# EasyEDA Pro project ProPrj_NERVA_Charger_2026-04-29.epro

# Schematic Schematic1
Board Name: Board1; Create Date: 2026-04-25; Page Name: P1; Project Name: NERVA_Charger; Schematic Name: Schematic1; Update Date: 2026-04-25; Company: EasyEDA.com; Page Size: A4; Version: V1.0
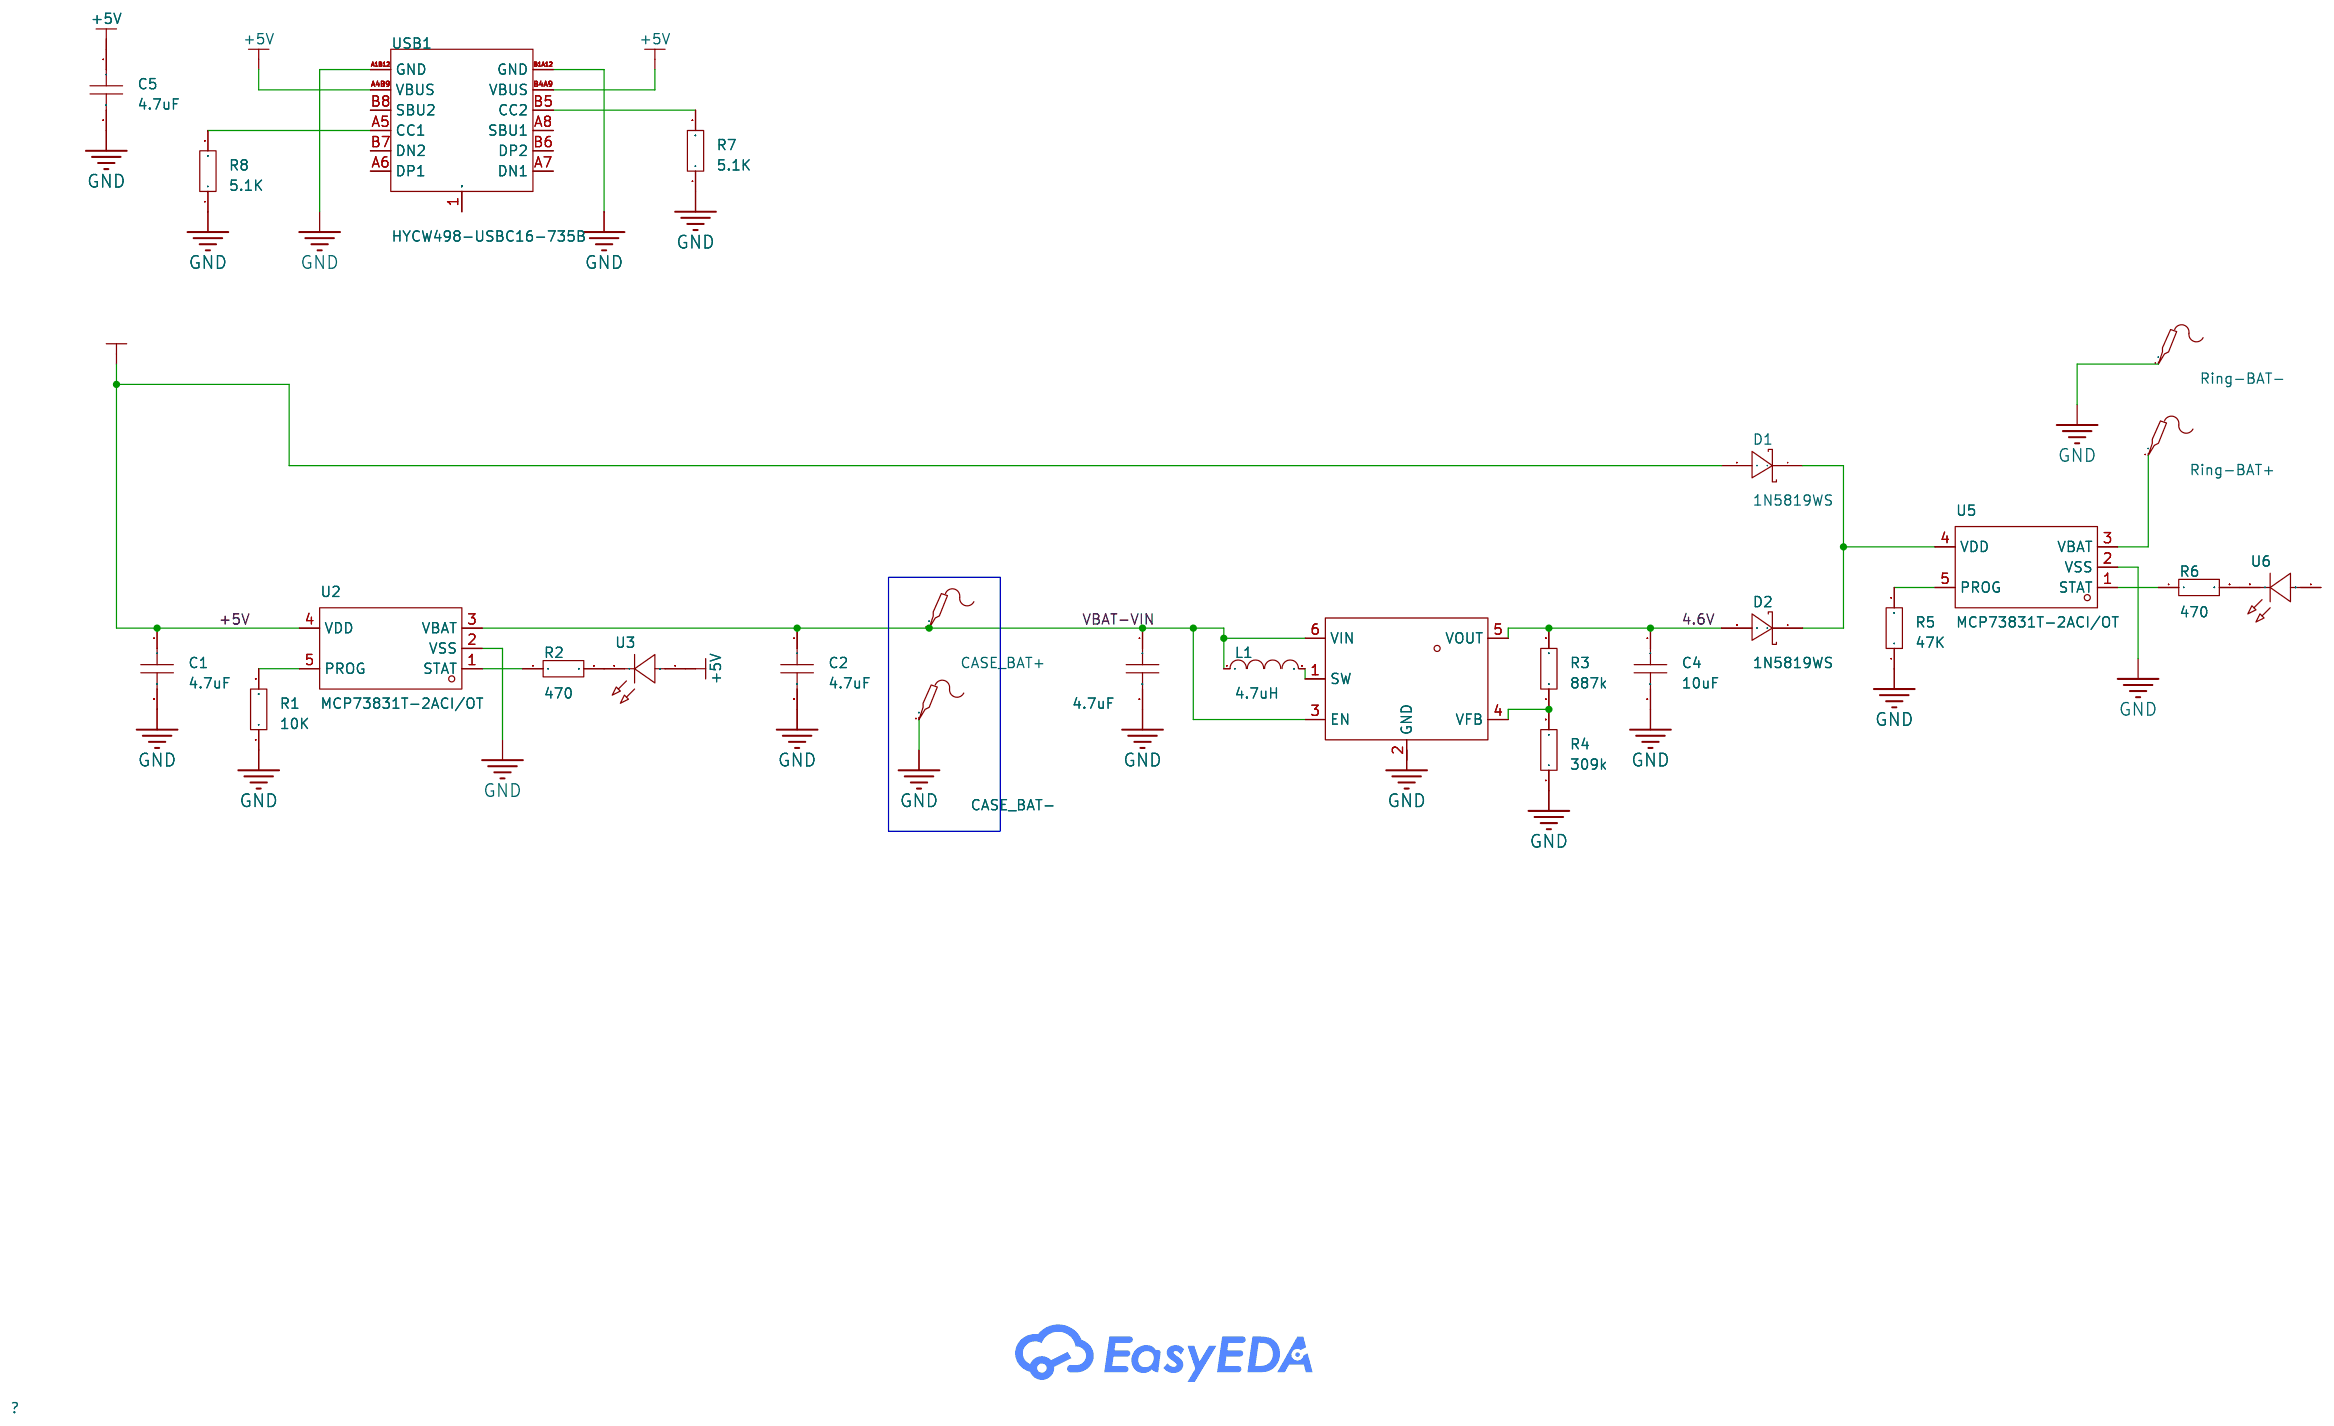
[diagram p0: schematic sheet]

## Parts
C1  4.7uF  [C0805]
C2  4.7uF  [C0805]
C3  4.7uF  [C0805]
C4  10uF  [C0805]
C5  4.7uF  [C0805]
CASE_BAT+  -  [Test-Point-0.5mm]
CASE_BAT-  -  [Test-Point-0.5mm]
D1  1N5819WS  [SOD-323_L1.8-W1.3-LS2.5-RD]
D2  1N5819WS  [SOD-323_L1.8-W1.3-LS2.5-RD]
L1  4.7uH  [L0603]
R1  10K  [R0805]
R2  470  [R0805]
R3  887k  [R0805]
R4  309k  [R0805]
R5  47K  [R0805]
R6  470  [R0805]
R7  5.1K  [R0805]
R8  5.1K  [R0805]
Ring-BAT+  -  [Test-Point-0.5mm]
Ring-BAT-  -  [Test-Point-0.5mm]
U2  MCP73831T-2ACI/OT  [SOT-23-5_L3.0-W1.7-P0.95-LS2.8-BL]
U3  DY-5173URD/SN-A3(EL)(HF)  [LED-TH_L7.1-W2.4-FD]
U4  MCP1640BT-I/CHY  [SOT-23-6_L2.9-W1.6-P0.95-LS2.8-BR]
U5  MCP73831T-2ACI/OT  [SOT-23-5_L3.0-W1.7-P0.95-LS2.8-BL]
U6  DY-5173URD/SN-A3(EL)(HF)  [LED-TH_L7.1-W2.4-FD]
USB1  HYCW498-USBC16-735B  [USB-C-SMD_HYCW498-USBC16-735B]

## Library data of the parts
C1-C5 = CAP_0603: Supplier Footprint: 0603
CASE_BAT+ CASE_BAT- Ring-BAT+ Ring-BAT- = Test-Point: Test Point 测试点
D1 D2 = 1N5819WS_C191023: Voltage - Forward(Vf@If):600mV@1A Voltage - DC Reverse(Vr):40V Current - Rectified:1A Non-Repetitive Peak Forward Surge Current:25A; LCSC Part Name: 电压:40V 电流:1A; Supplier Part: C191023; Manufacturer: Hottech(合科泰); Supplier Footprint: SOD-323; JLCPCB Part Class: Basic Part; Datasheet: https://item.szlcsc.com/datasheet/1N5819WS/213850.html; Supplier: LCSC; Voltage - Forward(Vf@If): 600mV@1A; Voltage - DC Reverse(Vr): 40V; Current - Rectified: 1A; Non-Repetitive Peak Forward Surge Current: 25A
L1 = L_0603
R1-R8 = Res_0603: Supplier Footprint: 0603
U2 U5 = MCP73831T-2ACI/OT: The Chip Type:Charging IC Voltage - Supply:3.75V~6V Voltage - Supply:3.75V~6V Charge Current - Max:550mA Charging Saturation Voltage:4.2V End-Off Voltage:- Type of Battery:Lithium Battery Number of Cells:1 Number of Cells:1 Operating Temperature:-40℃~+85℃; LCSC Part Name: 单节锂离子/锂聚合物充电管理控制器; Supplier Part: C424093; Manufacturer: MICROCHIP(美国微芯); Supplier Footprint: SOT-23-5; JLCPCB Part Class: Extended Part; Datasheet: https://item.szlcsc.com/datasheet/MCP73831T-2ACI%252FOT/417116.html; Supplier: LCSC; The Chip Type: Charging IC; Voltage - Supply: 3.75V~6V; Charge Current - Max: 550mA; Charging Saturation Voltage: 4.2V; Type of Battery: Lithium Battery; Number of Cells: 1; Operating Temperature: -40℃~+85℃; Battery Temperature Detection: Not supported; Supply Current (Iq): 53uA
U3 U6 = DY-5173URD/SN-A3(EL)(HF): Lamp Holder Type:7.1mm Square Lens Illumination Color:Red Voltage - Forward(Vf):1.8V~2.4V Voltage - Forward(Vf):1.8V~2.4V Power(Watts):50mW Forward Current:20mA Wavelength - Dominant:620nm~630nm Wavelength - Dominant:620nm~630nm Peak Wavelength:631nm Diod; LCSC Part Name: 插件方形正红色; Supplier Part: C7433013; Manufacturer: TONYU(东裕); Supplier Footprint: DIP; JLCPCB Part Class: Extended Part; Datasheet: https://item.szlcsc.com/datasheet/DY-5173URD%252FSN-A3(EL)(HF)/8439477.html; Supplier: LCSC; Lamp Holder Type: 7.1mm Square Lens; Illumination Color: Red; Voltage - Forward(Vf): 1.8V~2.4V; Power(Watts): 50mW; Forward Current: 20mA; Wavelength - Dominant: 620nm~630nm; Peak Wavelength: 631nm; Diode Configuration: Discrete Diode; Lens Color: Frosted Red Lens; Luminous Intensity: 80mcd; Viewing Angle: 160°; Operating Temperature: -25℃~+80℃
U4 = MCP1640BT-I/CHY: Function:Boost Voltage - Supply:800mV~5.5V Voltage - Supply:800mV~5.5V Output Voltage:2V~5.5V Output Voltage:2V~5.5V Output Current:350mA Frequency - Switching:500kHz Frequency - Switching:500kHz Operating Temperature:-40℃~+125℃@(TJ) Operating Temperature; LCSC Part Name: 具备真输出断开或输入/输出旁路选项的 0.65V 启动同步升压调节器; Supplier Part: C478087; Manufacturer: MICROCHIP(美国微芯); Supplier Footprint: SOT-23-6; JLCPCB Part Class: Extended Part; Datasheet: https://item.szlcsc.com/datasheet/MCP1640BT-I%252FCHY/485396.html; Supplier: LCSC; Function: Boost; Voltage - Supply: 800mV~5.5V; Output Voltage: 2V~5.5V; Output Current: 350mA; Frequency - Switching: 500kHz; Operating Temperature: -40℃~+125℃@(TJ); Synchronous Rectifier: Yes; Number of Outputs: 1; Topology: Boost; Quiescent Current: 19uA; Switch tube (built-in/external): Built-In; Output Type: Adjustable
USB1 = HYCW498-USBC16-735B: Connector Type:Type-C Protocol Standard:- Gender:Female Mounting Type:Surface Mount, Right Angle Number of Contacts:16P Number of Ports:1 Current Rating-Power:3A Voltage Rating:- Connect-Disconnect Life:10,000 Cycles Length:7.35mm Detection color:Black Op; LCSC Part Name: Type-C 母 卧贴; Supplier Part: C42400252; Manufacturer: 华宇创; Supplier Footprint: SMD; JLCPCB Part Class: Extended Part; Datasheet: https://item.szlcsc.com/datasheet/HYCW498-USBC16-735B/44352785.html; Supplier: LCSC; Connector Type: Type-C; Gender: Female; Mounting Type: Surface Mount, Right Angle; Number of Contacts: 16P; Number of Ports: 1; Current Rating-Power: 3A; Connect-Disconnect Life: 10,000 Cycles; Length: 7.35mm; Detection color: Black; Operating Temperature: -30℃~+85℃

## Nets
4.6V: C4.1 D2.2(A) R3.2 U4.5(VOUT)
+5V: C1.1 C5.1 D1.2(A) U2.4(VDD) U3.1(C) USB1.A4B9(VBUS) USB1.B4A9(VBUS)
GND: C1.2 C2.2 C3.2 C4.2 C5.2 CASE_BAT-.1 R1.1 R4.1 R5.1 R7.1 R8.1 Ring-BAT-.1 U2.2(VSS) U4.2(GND) U5.2(VSS) USB1.A1B12(GND) USB1.B1A12(GND)
VBAT-VIN: C2.1 C3.1 CASE_BAT+.1 L1.1 U2.3(VBAT) U4.3(EN) U4.6(VIN)
$1N534: R1.2 U2.5(PROG)
$1N679: R2.2 U3.2(A)
$1N707: R2.1 U2.1(STAT)
$1N1623: L1.2 U4.1(SW)
$1N2374: R3.1 R4.2 U4.4(VFB)
$1N2556: D1.1(K) D2.1(K) U5.4(VDD)
$1N2755: R5.2 U5.5(PROG)
$1N2757: R6.1 U5.1(STAT)
$1N2761: R6.2 U6.2(A)
$1N2793: Ring-BAT+.1 U5.3(VBAT)
$1N3240: R7.2 USB1.B5(CC2)
$1N3309: R8.2 USB1.A5(CC1)

Not connected (* = marked no-connect by the designer): U6 1(C); USB1 1(SHELL) A6(DP1) A7(DN1) A8(SBU1) B6(DP2) B7(DN2) B8(SBU2)

# Board PCB1
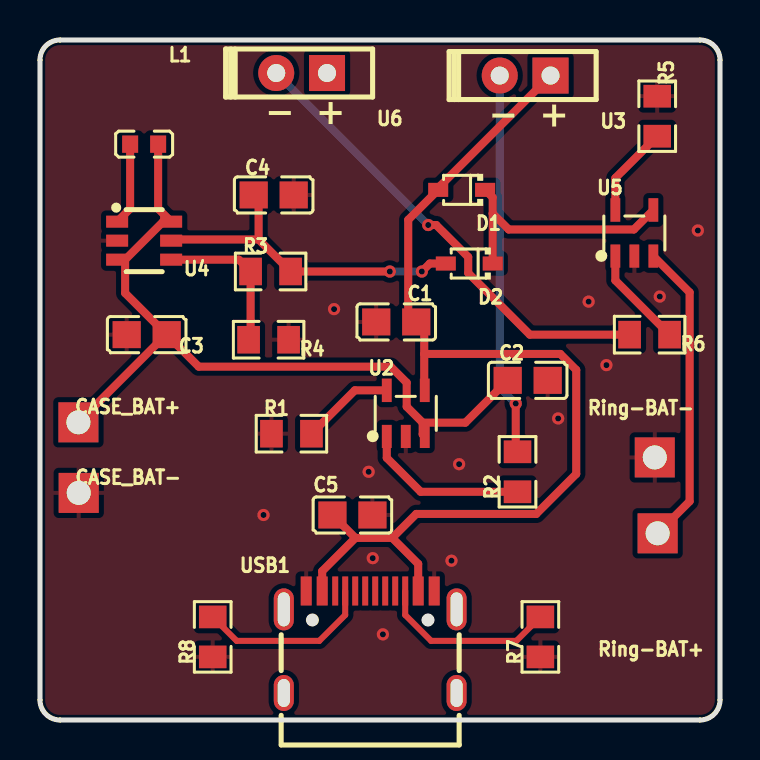
[diagram p1: board, top side]
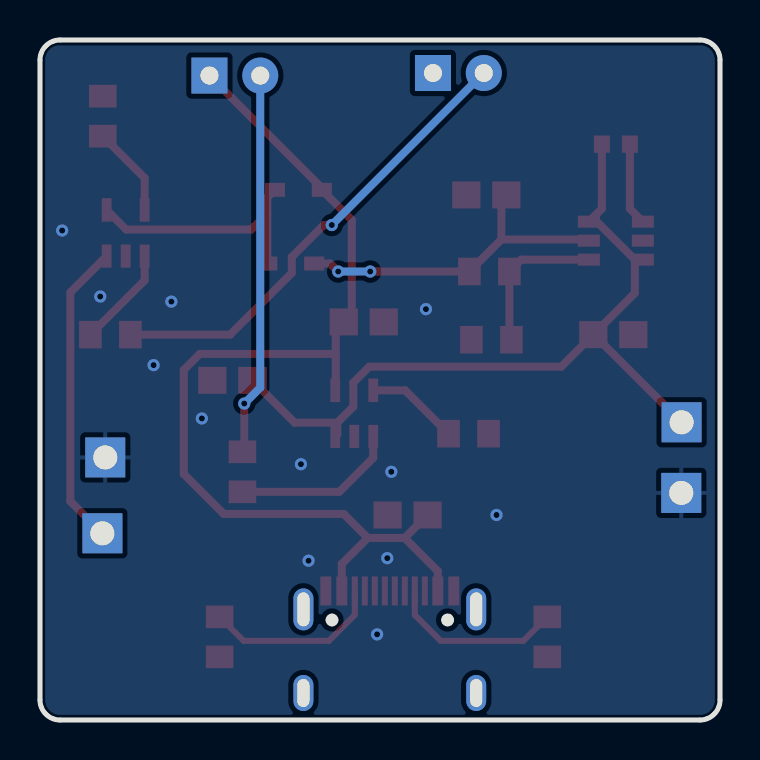
[diagram p2: board, bottom side, seen from below]

Outline 34 x 34 mm; copper layers: Top Layer, Bottom Layer. Coordinates in mm from the lower left corner of the outline.
Outline path: 0,33 0,1 arc(0.29,0.29) 1,0 33,0 arc(33.71,0.29) 34,1 34,33 arc(33.71,33.71) 33,34 1,34 arc(0.29,33.71) 0,33
Stack: Top Layer 0.035mm / Dielectric1 1.51mm FR4 er 4.5 / Bottom Layer 0.035mm

## Design rules (mm)
template: Custom Config
spacing copperThickness1oz (default): track to track 0.102, other pairs 0.152 to 0.3
spacing copperThickness2oz: track to track 0.203, other pairs 0.152 to 0.3
track width copperThickness1oz (default): min 0.127, default 0.4, max 2.54
track width copperThickness2oz: min 0.203, default 0.254, max 2.54
differential pair differentialPair (default): width min 0.127, default 0.254, max 2.54; gap min 0.152, default 0.152
via viaSize (default): diameter min 0.5, default 0.61, max 10; hole min 0.3, default 0.305, max 6.3

## Placement (name value [footprint] x y rotation side)
C1  4.7uF  [C0805]  17.81 19.9 180 top
C2  4.7uF  [C0805]  24.38 16.98 0 top
C3  4.7uF  [C0805]  5.33 19.27 180 top
C4  10uF  [C0805]  11.68 26.25 0 top
C5  4.7uF  [C0805]  15.62 10.25 0 top
CASE_BAT+  -  [Test-Point-0.5mm]  1.92 14.88 0 top
CASE_BAT-  -  [Test-Point-0.5mm]  1.94 11.35 0 top
D1  1N5819WS  [SOD-323_L1.8-W1.3-LS2.5-RD]  21.08 26.51 180 top
D2  1N5819WS  [SOD-323_L1.8-W1.3-LS2.5-RD]  21.46 22.82 180 top
L1  4.7uH  [L0603]  5.21 28.79 180 top
R1  10K  [R0805]  12.57 14.31 0 top
R2  470  [R0805]  23.88 12.41 90 top
R3  887k  [R0805]  11.53 22.43 0 top
R4  309k  [R0805]  11.43 19.01 180 top
R5  47K  [R0805]  30.86 30.19 270 top
R6  470  [R0805]  30.48 19.27 180 top
R7  5.1K  [R0805]  25.02 4.16 90 top
R8  5.1K  [R0805]  8.64 4.16 90 top
Ring-BAT+  -  [Test-Point-0.5mm]  30.88 9.33 0 top
Ring-BAT-  -  [Test-Point-0.5mm]  30.74 13.13 0 top
U2  MCP73831T-2ACI/OT  [SOT-23-5_L3.0-W1.7-P0.95-LS2.8-BL]  18.29 15.33 0 top
U3  DY-5173URD/SN-A3(EL)(HF)  [LED-TH_L7.1-W2.4-FD]  24.26 32.22 180 top
U4  MCP1640BT-I/CHY  [SOT-23-6_L2.9-W1.6-P0.95-LS2.8-BR]  5.21 23.97 180 top
U5  MCP73831T-2ACI/OT  [SOT-23-5_L3.0-W1.7-P0.95-LS2.8-BL]  29.72 24.35 0 top
U6  DY-5173URD/SN-A3(EL)(HF)  [LED-TH_L7.1-W2.4-FD]  13.08 32.35 180 top
USB1  HYCW498-USBC16-735B  [USB-C-SMD_HYCW498-USBC16-735B]  16.51 3.9 0 top

## Footprints (pads in the part's own frame, mm; a bottom-side part is the same pattern mirrored in y, then rotated)
C0805
  rect 1.41x1.35 smd: 1(-1,0) 2(1,0)
L0603
  rect 0.8x0.864 smd: 1(-0.7,0) 2(0.7,0)
LED-TH_L7.1-W2.4-FD
  rect 1.8x1.8 hole 0.9: 1(-1.27,0)
  round 1.8 hole 0.9: 2(1.27,0)
R0805
  rect 1.133x1.377 smd: 1(-1,0) 2(1,0)
SOD-323_L1.8-W1.3-LS2.5-RD
  rect 1x0.7 smd: 1(-1.173,0) 2(1.173,0)
SOT-23-5_L3.0-W1.7-P0.95-LS2.8-BL
  rect 0.49x1.157 smd: 1(-0.95,-1.153) 2(0,-1.153) 3(0.95,-1.153)
  rect 0.49x1.175 smd: 4(0.95,1.153) 5(-0.95,1.153)
SOT-23-6_L2.9-W1.6-P0.95-LS2.8-BR
  rect 1.1x0.6 smd: 1(1.35,-0.95) 2(1.35,0) 3(1.35,0.95) 4(-1.35,0.95) 5(-1.35,0) 6(-1.35,-0.95)
Test-Point-0.5mm
  rect 2x2 hole 1.2: 1(0,0)
USB-C-SMD_HYCW498-USBC16-735B
  oval 1x2.1 hole 0.6x1.7: 1(-4.32,1.63) 2(4.32,1.63)
  oval 1x1.8 hole 0.6x1.4: 3(-4.32,-2.55) 4(4.32,-2.55)
  rect 0.55x1.45 smd: A1B12(-3.2,2.55) A4B9(-2.4,2.55) B1A12(3.2,2.55) B4A9(2.4,2.55)
  rect 0.3x1.45 smd: A5(-1.25,2.55) A6(-0.25,2.55) A7(0.25,2.55) A8(1.25,2.55) B5(1.75,2.55) B6(0.75,2.55) B7(-0.75,2.55) B8(-1.75,2.55)

## Nets
As in the schematic.

Pads without a net: U6 1; USB1 1 2 3 4 A6 A7 A8 B6 B7 B8

## Via types
v1: diameter 0.61, hole 0.305, Top Layer to Bottom Layer, 16 vias

## Routing (per net, layer and track width the routed paths; a pad name or vN(x,y) marks a point on that pad's centre or on a via; arc(x,y) is an arc through that point)
4.6V: length 16.9
  Top Layer w0.4: 10.93,24.03 10.93,26.01 C4.1 ; 10.93,24.03 R3.2 ; 10.93,24.03 6.62,24.03 U4.5 ; v1(17.49,22.42) 12.53,22.42 ; v1(19.09,22.42) 19.49,22.82 D2.2
  Bottom Layer w0.4: v1(19.09,22.42) v1(17.49,22.42)
+5V: length 52.7
  Top Layer w0.4: 15.77,9.1 14.11,7.44 USB1.A4B9 ; 15.77,9.1 17.61,9.1 ; 15.77,9.1 C5.1 ; 19.24,16.48 19.21,16.51 19.21,18.3 ; 17.61,9.1 18.81,10.3 24.81,10.3 26.81,12.3 26.81,17.5 26.01,18.3 19.21,18.3 ; 17.61,9.1 18.91,7.8 USB1.B4A9 ; 19.21,18.3 19.21,19.5 C1.1 18.41,20.3 18.41,25.01 D1.2 19.91,26.6 U3.1
GND:
  vias: v1(11.18,10.25) v1(14.7,20.54) v1(16.43,12.41) v1(16.64,8.09) v1(17.14,4.28) v1(20.57,7.96) v1(20.95,12.79) v1(25.91,15.08) v1(27.43,20.92) v1(28.32,17.74) v1(30.99,21.17) v1(32.89,24.47)
VBAT-VIN: length 39.7
  Top Layer w0.4: C3.1 6.3,19.27 CASE_BAT+.1 ; C3.1 7.93,17.67 17.53,17.67 18.33,16.87 18.33,15.67 19.13,14.87 ; C3.1 4.26,21.34 4.26,23.02 ; 4.26,23.02 6.16,24.92 U4.6 5.91,25.57 L1.1 ; 4.26,23.02 U4.3 ; 19.13,14.87 19.13,14.28 19.24,14.18 ; 19.13,14.87 21.27,14.87 C2.1
$1N534: length 4.7
  Top Layer w0.4: U2.5 15.74,16.48 R1.2
$1N679: length 19.2
  Top Layer w0.4: v1(23.79,15.82) 23.79,13.5 R2.2
  Bottom Layer w0.4: v1(23.79,15.82) 22.99,16.62 U3.2
$1N707: length 8.3
  Top Layer w0.4: R2.1 19.03,11.41 17.34,13.11 U2.1
$1N1623: length 4.1
  Top Layer w0.4: L1.2 4.51,25.57 U4.1
$1N2374: length 7.7
  Top Layer w0.4: U4.4 9.94,23.02 R3.1 10.53,19.11 R4.2
$1N2556: length 12.6
  Top Layer w0.4: U5.4 29.69,24.53 23.44,24.53 22.64,25.33 ; 22.64,25.33 22.64,26.13 D1.1 ; 22.64,25.33 D2.1
$1N2755: length 4.6
  Top Layer w0.4: R5.2 28.77,27.1 U5.5
$1N2757: length 5
  Top Layer w0.4: R6.1 28.77,21.98 U5.1
$1N2761: length 23.6
  Top Layer w0.4: v1(19.41,24.75) 19.81,24.75 21.41,23.15 21.41,22.35 24.49,19.27 R6.2
  Bottom Layer w0.4: U6.2 v1(19.41,24.75)
$1N2793: length 15.3
  Top Layer w0.4: U5.3 32.48,21.38 32.48,10.93 Ring-BAT+.1
$1N3240: length 9
  Top Layer w0.3: USB1.B5 18.26,5.25 19.56,3.95 23.82,3.95 R7.2
$1N3309: length 8.9
  Top Layer w0.3: USB1.A5 15.26,5.25 13.96,3.95 9.84,3.95 R8.2

## Copper pours and planes (outline as drawn; the poured copper is in the pictures)
GND on Top Layer: 0,33.75 34,33.75 34,0 0,0
GND on Bottom Layer: 0.14,33.73 34.14,33.73 34.14,-0.02 0.14,-0.02
